# EAGLE design REEF_1V0 (EAGLE 8.3.1)
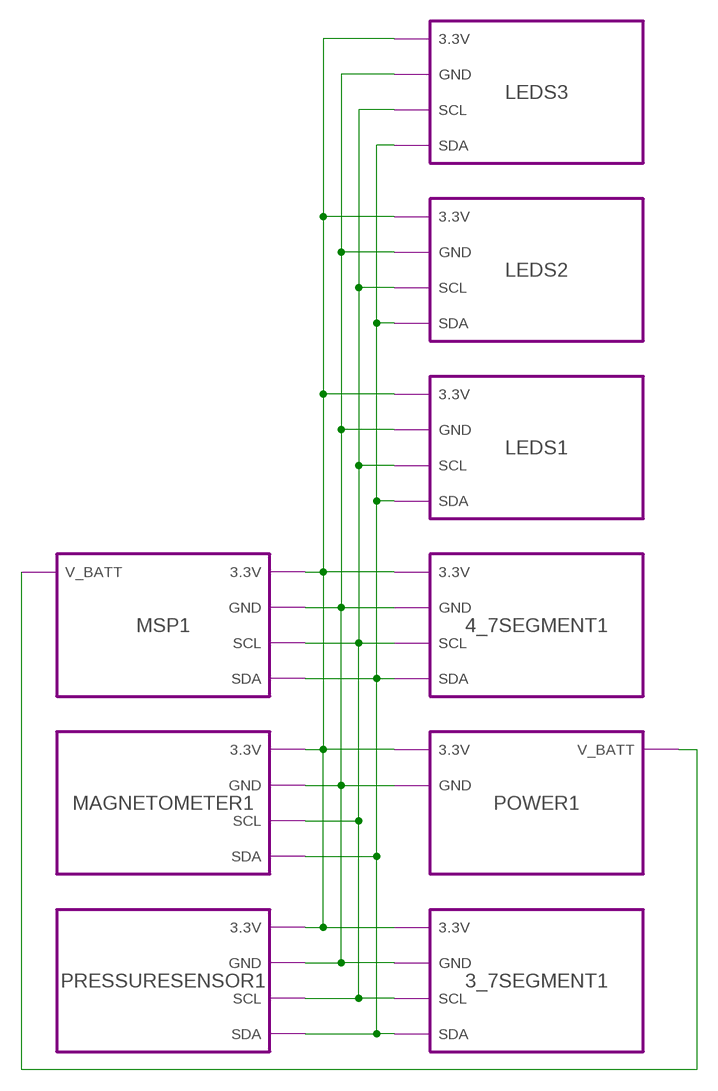
[diagram p0: schematic, sheet 1]

## Module instances
3_7SEGMENT1 = 3_7SEGMENT
4_7SEGMENT1 = 4_7SEGMENT
MAGNETOMETER1 = MAGNETOMETER
POWER1 = POWER
PRESSURESENSOR1 = PRESSURESENSOR
MSP1 = MSP
LEDS1 = LEDS
LEDS2 = LEDS
LEDS3 = LEDS

## Nets
3.3V: port MAGNETOMETER1.3.3V PRESSURESENSOR1.3.3V POWER1.3.3V MSP1.3.3V LEDS3.3.3V 3_7SEGMENT1.3.3V LEDS2.3.3V LEDS1.3.3V 4_7SEGMENT1.3.3V
GND: port MAGNETOMETER1.GND POWER1.GND PRESSURESENSOR1.GND 4_7SEGMENT1.GND 3_7SEGMENT1.GND MSP1.GND LEDS3.GND LEDS2.GND LEDS1.GND
N$1: port POWER1.V_BATT MSP1.V_BATT
SCL: port PRESSURESENSOR1.SCL 4_7SEGMENT1.SCL MAGNETOMETER1.SCL 3_7SEGMENT1.SCL MSP1.SCL LEDS3.SCL LEDS2.SCL LEDS1.SCL
SDA: port PRESSURESENSOR1.SDA 4_7SEGMENT1.SDA MAGNETOMETER1.SDA 3_7SEGMENT1.SDA MSP1.SDA LEDS3.SDA LEDS2.SDA LEDS1.SDA

## Library data of the parts

## Module MAGNETOMETER
Ports: 3.3V(io) GND(io) SCL(io) SDA(io)
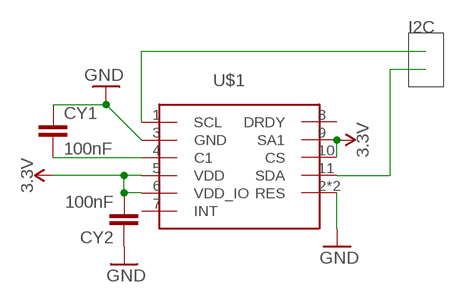
[diagram p1: schematic, module MAGNETOMETER, sheet 1]

### Parts
CY1  100nF  CYYC7B5  [YC7B5]
CY2  100nF  CYYC7B5  [YC7B5]
U$1  LIS3MDLTR  [LGA-12]

### Nets
3.3V: CY2.2 U$1.5(VDD) U$1.6(VDD_IO) U$1.9(SA1) U$1.10(CS)
GND: CY1.1 CY2.1 U$1.2(RES) U$1.3(GND) U$1.12(RES)
N$3: CY1.2 U$1.4(C1)
SCL: U$1.1(SCL)
SDA: U$1.11(SDA)
Unconnected: U$1.7(INT) U$1.8(DRDY)

### Notes on the sheet
- I2C

### Library data of the parts
CY1 CY2 = rcl:CY: Y CAPACITOR for power line
U$1 = LED Driver:LIS3MDLTR

## Module POWER
Ports: GND(io) 3.3V(io) V_BATT(io)
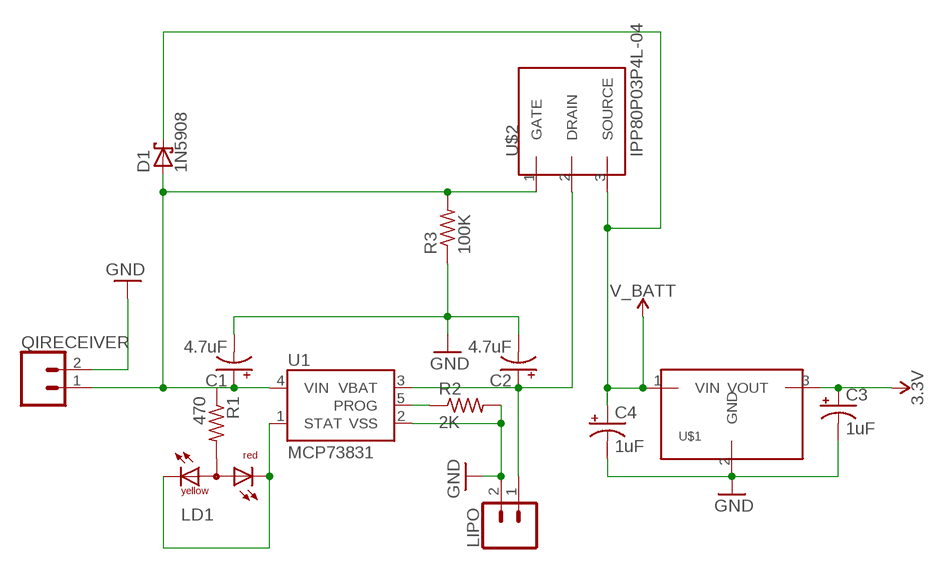
[diagram p2: schematic, module POWER, sheet 1]

### Parts
C1  4.7uF  1000UF-RADIAL-5MM-25V-20%  [CPOL-RADIAL-5MM-10MM]
C2  4.7uF  1000UF-RADIAL-5MM-25V-20%  [CPOL-RADIAL-5MM-10MM]
C3  1uF  1000UF-RADIAL-5MM-25V-20%  [CPOL-RADIAL-5MM-10MM]
C4  1uF  1000UF-RADIAL-5MM-25V-20%  [CPOL-RADIAL-5MM-10MM]
D1  1N5908  [C4111-15]
LD1  DUOLED-RY-A  [DUOLED-A-5MM]
LIPO  CONN_02  [1X02]
QIRECEIVER  CONN_02  [1X02]
R1  470  R-US_VMTA55  [VMTA55]
R2  2K  R-US_VMTA55  [VMTA55]
R3  100K  R-US_VMTA55  [VMTA55]
U1  MCP73831  [SOT23-5]
U$1  MCP1826S  [T03B]
U$2  IPP80P03P4L-04  [T03B]

### Nets
3.3V: C3.+ U$1.3(VOUT)
GND: C1.- C2.- C3.- C4.- LIPO.2 QIRECEIVER.2 R2.2 R3.1 U1.2(VSS) U$1.2(GND)
N$2: C2.+ LIPO.1 U1.3(VBAT) U$2.2(DRAIN)
N$3: LD1.CR LD1.CX(CY) U1.1(STAT)
N$4: C1.+ D1.A QIRECEIVER.1 R1.1 R3.2 U1.4(VIN) U$2.1(GATE)
N$6: R2.1 U1.5(PROG)
N$7: LD1.A R1.2
V_BATT: C4.+ D1.C U$1.1(VIN) U$2.3(SOURCE)

### Library data of the parts
C1-C4 = SparkFun-Capacitors:1000UF: 1,000µF/1mF ceramic capacitors A capacitor is a passive two-terminal electrical component used to store electrical energy temporarily in an electric field. CAP-08070; PROD_ID: CAP-09538; VALUE: 1mF
D1 = diode:1N5908: DIODE schottky
LD1 = led:DUOLED-RY-A: DUO LED 2 colors (red/yellow), 5 mm, round, common Anode www.ligitek.com or other producers.
LIPO QIRECEIVER = SparkFun-Connectors:CONN_02: Multi connection point. Often used as Generic Header-pin footprint for 0.1 inch spaced/style header connections On any of the 0.1 inch spaced packages, you can populate with these: Break Away Headers - Straight <https://www.sparkfun.com/products/116> (PRT-00116) Break Away Male Headers - Right Angle <https://www.sparkfun.com/products/553> (PRT-00553) Female Headers <https://www.sparkfun.com/products/115> (PRT-00115) Break Away Headers - Machine Pin <https://www.sparkfun.com/products/117> (PRT-00117) Break Away Female Headers - Swiss Machine Pin <https://www.sparkfun.com/products/743> (PRT-00743) For SCREWTERMINALS and SPRING TERMINALS visit here: Screw Terimnals on SparkFun.com <https://www.sparkfun.com/search/results?term=Screw+Terminals> (5mm/3.5mm/2.54mm spacing) This device is also useful as a general connection point to wire up your design to another part of your project. Our various solder wires solder well into these plated through hole pads. Hook-Up Wire - Assortment (Stranded, 22 AWG) <https://www.sparkfun.com/products/11375> (PRT-11375) Hook-Up Wire - Assortment (Solid Core, 22 AWG) <https://www.sparkfun.com/products/11367> (PRT-11367) View the entire wire category on our website here <https://www.sparkfun.com/categories/141> Special notes: Molex polarized connector foot print use with: PRT-08233 with associated crimp pins and housings. 2.54_SCREWTERM for use with PRT-10571. 3.5mm Screw Terminal footprints for PRT-08084 5mm Screw Terminal footprints for use with PRT-08432
R1-R3 = rcl:R-US_: RESISTOR, American symbol
U1 = SparkFun-IC-Power:MCP73831: MCP73831T Li-Ion, Li-Pol Controller Miniature single cell, fully integrated Li-Ion, Li-polymer charge management controller Datasheet <http://ww1.microchip.com/downloads/en/DeviceDoc/20001984g.pdf> SparkFun Products: SparkFun ESP32 Thing <https://www.sparkfun.com/products/13907> SparkFun 9DoF Razor IMU M0 <https://www.sparkfun.com/products/14001>; PROD_ID: IC-09995
U$1 = LED Driver:MCP1826S
U$2 = LED Driver:IPP80P03P4L-04

## Module 4_7SEGMENT
Ports: GND(io) SCL(io) SDA(io) 3.3V(io)
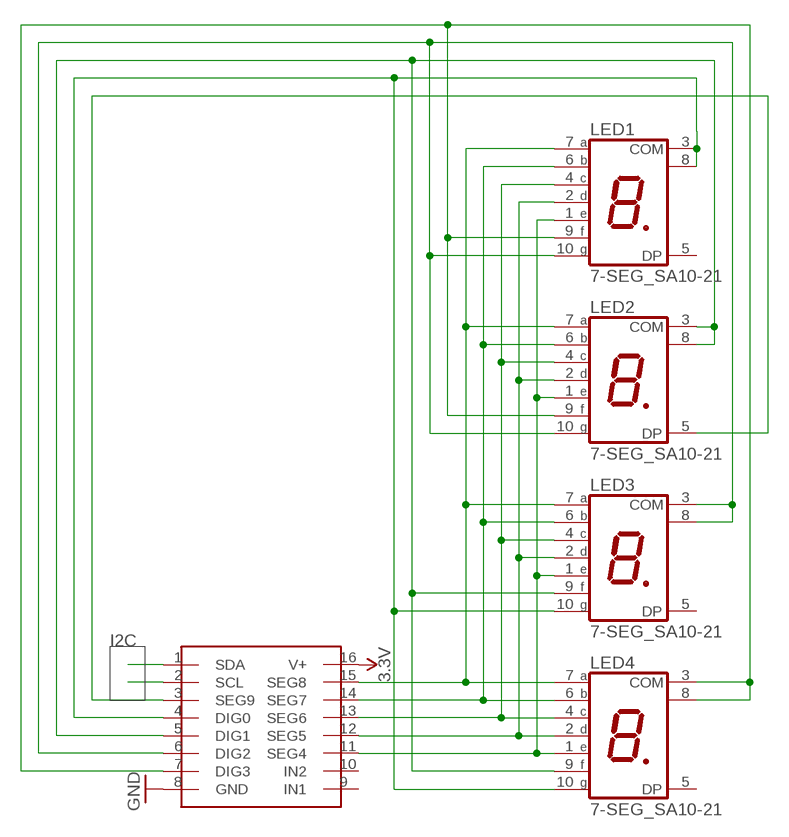
[diagram p3: schematic, module 4_7SEGMENT, sheet 1]

### Parts
LED1  7-SEG_SA10-21  [SA10-21]
LED2  7-SEG_SA10-21  [SA10-21]
LED3  7-SEG_SA10-21  [SA10-21]
LED4  7-SEG_SA10-21  [SA10-21]
U$1  MAX6958BAPE+  [DIP16]

### Nets
3.3V: U$1.16(V+)
GND: U$1.8(GND)
N$1: LED1.7(A) LED2.7(A) LED3.7(A) LED4.7(A) U$1.15(SEG8)
N$2: LED1.6(B) LED2.6(B) LED3.6(B) LED4.6(B) U$1.14(SEG7)
N$3: LED1.4(C) LED2.4(C) LED3.4(C) LED4.4(C) U$1.13(SEG6)
N$4: LED1.2(D) LED2.2(D) LED3.2(D) LED4.2(D) U$1.12(SEG5)
N$5: LED1.1(E) LED2.1(E) LED3.1(E) LED4.1(E) U$1.11(SEG4)
N$6: LED1.3(COM) LED1.8(COM) LED3.10(G) LED4.10(G) U$1.4(DIG0)
N$7: LED2.3(COM) LED2.8(COM) LED3.9(F) LED4.9(F) U$1.5(DIG1)
N$8: LED2.5(DP) U$1.3(SEG9)
N$9: LED1.9(F) LED2.9(F) LED4.3(COM) LED4.8(COM) U$1.7(DIG3)
N$11: LED1.10(G) LED2.10(G) LED3.3(COM) LED3.8(COM) U$1.6(DIG2)
SCL: U$1.2(SCL)
SDA: U$1.1(SDA)
Unconnected: LED1.5(DP) LED3.5(DP) LED4.5(DP) U$1.9(IN1) U$1.10(IN2)

### Notes on the sheet
- I2C

### Library data of the parts
LED1-LED4 = display-kingbright:7-SEG_: Kingbright 14.2mm (0.56 INCH) SINGLE DIGIT NUMERIC DUISPLAY Source: SA56-11EWA(Ver1189471036.pdf; OC_FARNELL: unknown; OC_NEWARK: unknown
U$1 = LED Driver:MAX6958BAPE+

## Module 3_7SEGMENT
Ports: GND(io) SCL(io) SDA(io) 3.3V(io)
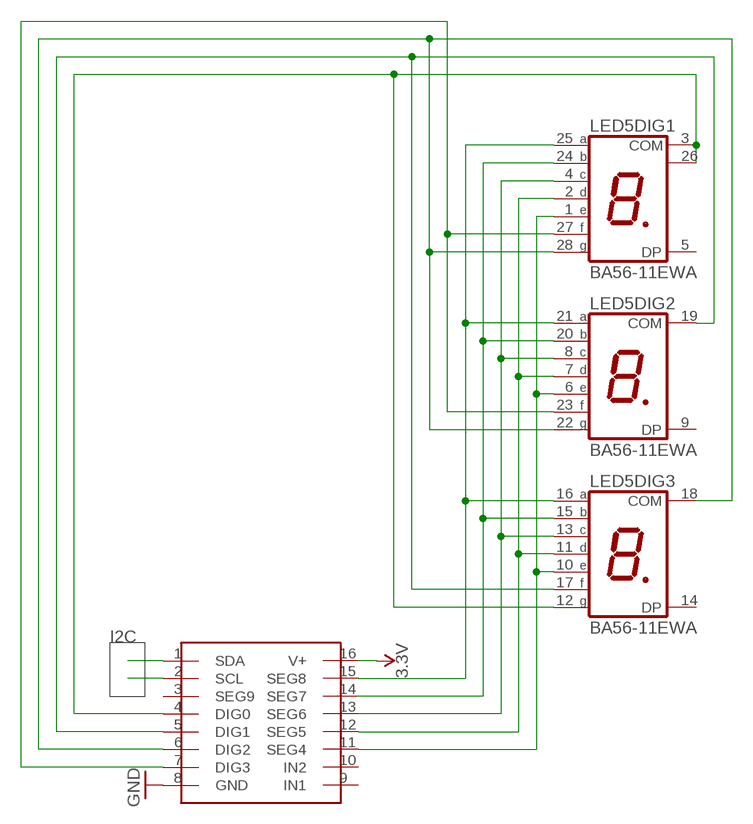
[diagram p4: schematic, module 3_7SEGMENT, sheet 1]

### Parts
LED5  BA56-11EWA  [BA/BC56]
U$1  MAX6958BAPE+  [DIP16]

### Nets
3.3V: U$1.16(V+)
GND: U$1.8(GND)
N$1: LED5.3(DIG1:COM) LED5.12(DIG3:G) LED5.26(DIG1:COM) U$1.4(DIG0)
N$8: LED5.16(DIG3:A) LED5.21(DIG2:A) LED5.25(DIG1:A) U$1.15(SEG8)
N$9: LED5.15(DIG3:B) LED5.20(DIG2:B) LED5.24(DIG1:B) U$1.14(SEG7)
N$10: LED5.4(DIG1:C) LED5.8(DIG2:C) LED5.13(DIG3:C) U$1.13(SEG6)
N$11: LED5.2(DIG1:D) LED5.7(DIG2:D) LED5.11(DIG3:D) U$1.12(SEG5)
N$26: LED5.1(DIG1:E) LED5.6(DIG2:E) LED5.10(DIG3:E) U$1.11(SEG4)
N$28: LED5.17(DIG3:F) LED5.19(DIG2:COM) U$1.5(DIG1)
N$29: LED5.23(DIG2:F) LED5.27(DIG1:F) U$1.7(DIG3)
N$30: LED5.18(DIG3:COM) LED5.22(DIG2:G) LED5.28(DIG1:G) U$1.6(DIG2)
SCL: U$1.2(SCL)
SDA: U$1.1(SDA)
Unconnected: LED5.5(DIG1:DP) LED5.9(DIG2:DP) LED5.14(DIG3:DP) U$1.3(SEG9) U$1.9(IN1) U$1.10(IN2)

### Notes on the sheet
- I2C

### Library data of the parts
LED5 = display-kingbright:B?56-11*WA: 14.22mm (0.56INCH) THREE DIGIT NUMERIC DISPLAY Source: http://www.kingbright.com .. BA56-11EWA(Ver1189474895.pdf; OC_FARNELL: unknown; OC_NEWARK: unknown
U$1 = LED Driver:MAX6958BAPE+

## Module PRESSURESENSOR
Ports: 3.3V(io) GND(io) SCL(io) SDA(io)
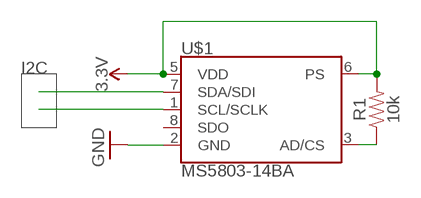
[diagram p5: schematic, module PRESSURESENSOR, sheet 1]

### Parts
R1  10k  10KOHM-HORIZ-1/4W-5%  [AXIAL-0.3]
U$1  MS5803-14BA  [DIL8]

### Nets
3.3V: R1.P$2 U$1.5(VDD) U$1.6(PS)
GND: U$1.2(GND)
N$1: R1.P$1 U$1.3(AD/CS)
SCL: U$1.1(SCL/SCLK)
SDA: U$1.7(SDA/SDI)
Unconnected: U$1.8(SDO)

### Notes on the sheet
- I2C

### Library data of the parts
R1 = SparkFun-Resistors:10KOHM: 10kΩ resistor A resistor is a passive two-terminal electrical component that implements electrical resistance as a circuit element. Resistors act to reduce current flow, and, at the same time, act to lower voltage levels within circuits. - Wikipedia; PROD_ID: RES-09435
U$1 = UnderwaterSensorProject:MS5803-14BA

## Module MSP
Ports: SDA(io) SCL(io) GND(io) 3.3V(io) V_BATT(io)
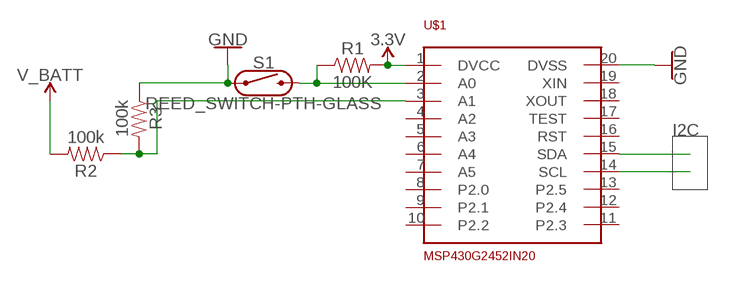
[diagram p6: schematic, module MSP, sheet 1]

### Parts
R1  100K  100OHM-HORIZ-1/4W-1%  [AXIAL-0.3]
R2  100k  100KOHM-HORIZ-1/4W-1%  [AXIAL-0.3]
R3  100k  100KOHM-HORIZ-1/4W-1%  [AXIAL-0.3]
S1  REED_SWITCH-PTH-GLASS  [REED_SWITCH_GLASS]
U$1  MSP430G2452IN20  [DIL20]

### Nets
3.3V: R1.P$2 U$1.1(DVCC)
GND: R3.P$1 S1.P$1 U$1.20(DVSS)
N$1: R1.P$1 S1.P$2 U$1.2(A0)
N$2: R2.P$1 R3.P$2 U$1.3(A1)
SCL: U$1.14(SCL)
SDA: U$1.15(SDA)
V_BATT: R2.P$2
Unconnected: U$1.4(A2) U$1.5(A3) U$1.6(A4) U$1.7(A5) U$1.8(P2.0) U$1.9(P2.1) U$1.10(P2.2) U$1.11(P2.3) U$1.12(P2.4) U$1.13(P2.5) U$1.16(RST) U$1.17(TEST) U$1.18(XOUT) U$1.19(XIN)

### Notes on the sheet
- I2C

### Library data of the parts
R1 = SparkFun-Resistors:100OHM: 100Ω resistor A resistor is a passive two-terminal electrical component that implements electrical resistance as a circuit element. Resistors act to reduce current flow, and, at the same time, act to lower voltage levels within circuits. - Wikipedia; PROD_ID: RES-12181; VALUE: 100
R2 R3 = SparkFun-Resistors:100KOHM: 100kΩ resistor A resistor is a passive two-terminal electrical component that implements electrical resistance as a circuit element. Resistors act to reduce current flow, and, at the same time, act to lower voltage levels within circuits. - Wikipedia; PROD_ID: RES-12184
S1 = SparkFun-Switches:REED_SWITCH: Reed Switch A reed switch is a magnetically-actuated switch. When the device is exposed to a magnetic field, the two ferrous materials inside the switch pull together and the switch closes. Variant Overview PTH-GLASS Reed Switch <https://www.sparkfun.com/products/8642> (COM-08642) - PTH reed switch w/ glass body (6.0 x 0.9 mm) PTH-INSULATED Reed Switch - Insulated <https://www.sparkfun.com/products/10601> (COM-10601) - PTH reed switch w/ insulated body (15.1 x 4.2 mm); PROD_ID: SWCH-09282; SF_SKU: COM-08642
U$1 = UnderwaterSensorProject:MSP430G2452IN20

## Module LEDS
Ports: SDA(io) SCL(io) GND(io) 3.3V(io)
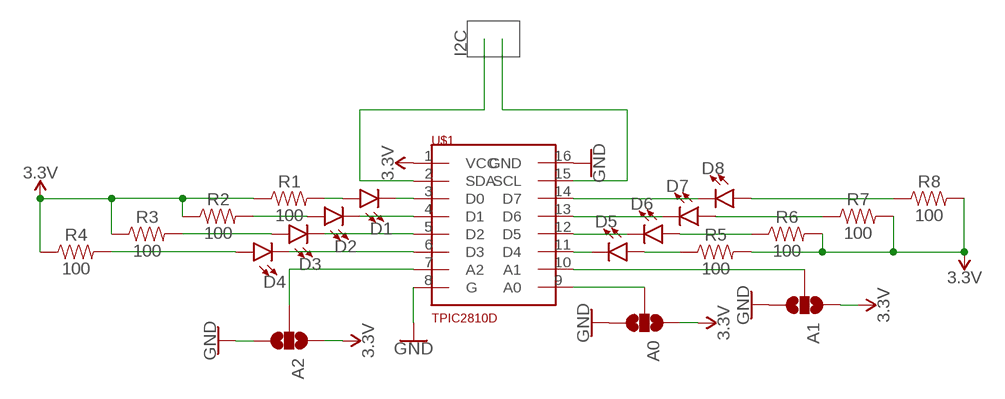
[diagram p7: schematic, module LEDS, sheet 1]

### Parts
A0  JUMPER-SMT_3_NO_SILK  [SMT-JUMPER_3_NO_SILK]
A1  JUMPER-SMT_3_NO_SILK  [SMT-JUMPER_3_NO_SILK]
A2  JUMPER-SMT_3_NO_SILK  [SMT-JUMPER_3_NO_SILK]
D1  LED5MM  [LED_5MM]
D2  LED5MM  [LED_5MM]
D3  LED5MM  [LED_5MM]
D4  LED5MM  [LED_5MM]
D5  LED5MM  [LED_5MM]
D6  LED5MM  [LED_5MM]
D7  LED5MM  [LED_5MM]
D8  LED5MM  [LED_5MM]
R1  100  100OHM-HORIZ-1/4W-1%  [AXIAL-0.3]
R2  100  100OHM-HORIZ-1/4W-1%  [AXIAL-0.3]
R3  100  100OHM-HORIZ-1/4W-1%  [AXIAL-0.3]
R4  100  100OHM-HORIZ-1/4W-1%  [AXIAL-0.3]
R5  100  100OHM-HORIZ-1/4W-1%  [AXIAL-0.3]
R6  100  100OHM-HORIZ-1/4W-1%  [AXIAL-0.3]
R7  100  100OHM-HORIZ-1/4W-1%  [AXIAL-0.3]
R8  100  100OHM-HORIZ-1/4W-1%  [AXIAL-0.3]
U$1  TPIC2810D  [SO16]

### Nets
3.3V: A0.1 A1.1 A2.1 R1.P$1 R2.P$1 R3.P$1 R4.P$1 R5.P$2 R6.P$2 R7.P$2 R8.P$2 U$1.1(VCC)
GND: A0.3 A1.3 A2.3 U$1.8(G) U$1.16(GND)
N$1: D1.K(C) U$1.3(D0)
N$2: D2.K(C) U$1.4(D1)
N$3: D3.K(C) U$1.5(D2)
N$4: D4.K(C) U$1.6(D3)
N$5: D5.K(C) U$1.11(D4)
N$6: D6.K(C) U$1.12(D5)
N$7: D7.K(C) U$1.13(D6)
N$8: D8.K(C) U$1.14(D7)
N$9: A2.2 U$1.7(A2)
N$10: A1.2 U$1.10(A1)
N$11: A0.2 U$1.9(A0)
N$12: D5.A R5.P$1
N$13: D6.A R6.P$1
N$14: D7.A R7.P$1
N$15: D8.A R8.P$1
N$16: D1.A R1.P$2
N$18: D2.A R2.P$2
N$19: D3.A R3.P$2
N$20: D4.A R4.P$2
SCL: U$1.15(SCL)
SDA: U$1.2(SDA)

### Notes on the sheet
- I2C

### Library data of the parts
A0 A1 A2 = SparkFun-Jumpers:JUMPER-SMT_3_NO: Normally open jumper This jumper has three pads in close proximity to each other. Apply solder to close the connection(s).
D1-D8 = SparkFun-LED:LED: LED (Generic) Standard schematic elements and footprints for 5mm, 3mm, 1206, and 0603 sized LEDs. Generic LEDs with no color specified.
R1-R8 = SparkFun-Resistors:100OHM: 100Ω resistor A resistor is a passive two-terminal electrical component that implements electrical resistance as a circuit element. Resistors act to reduce current flow, and, at the same time, act to lower voltage levels within circuits. - Wikipedia; PROD_ID: RES-12181
U$1 = UnderwaterSensorProject:TPIC2810D

## Board
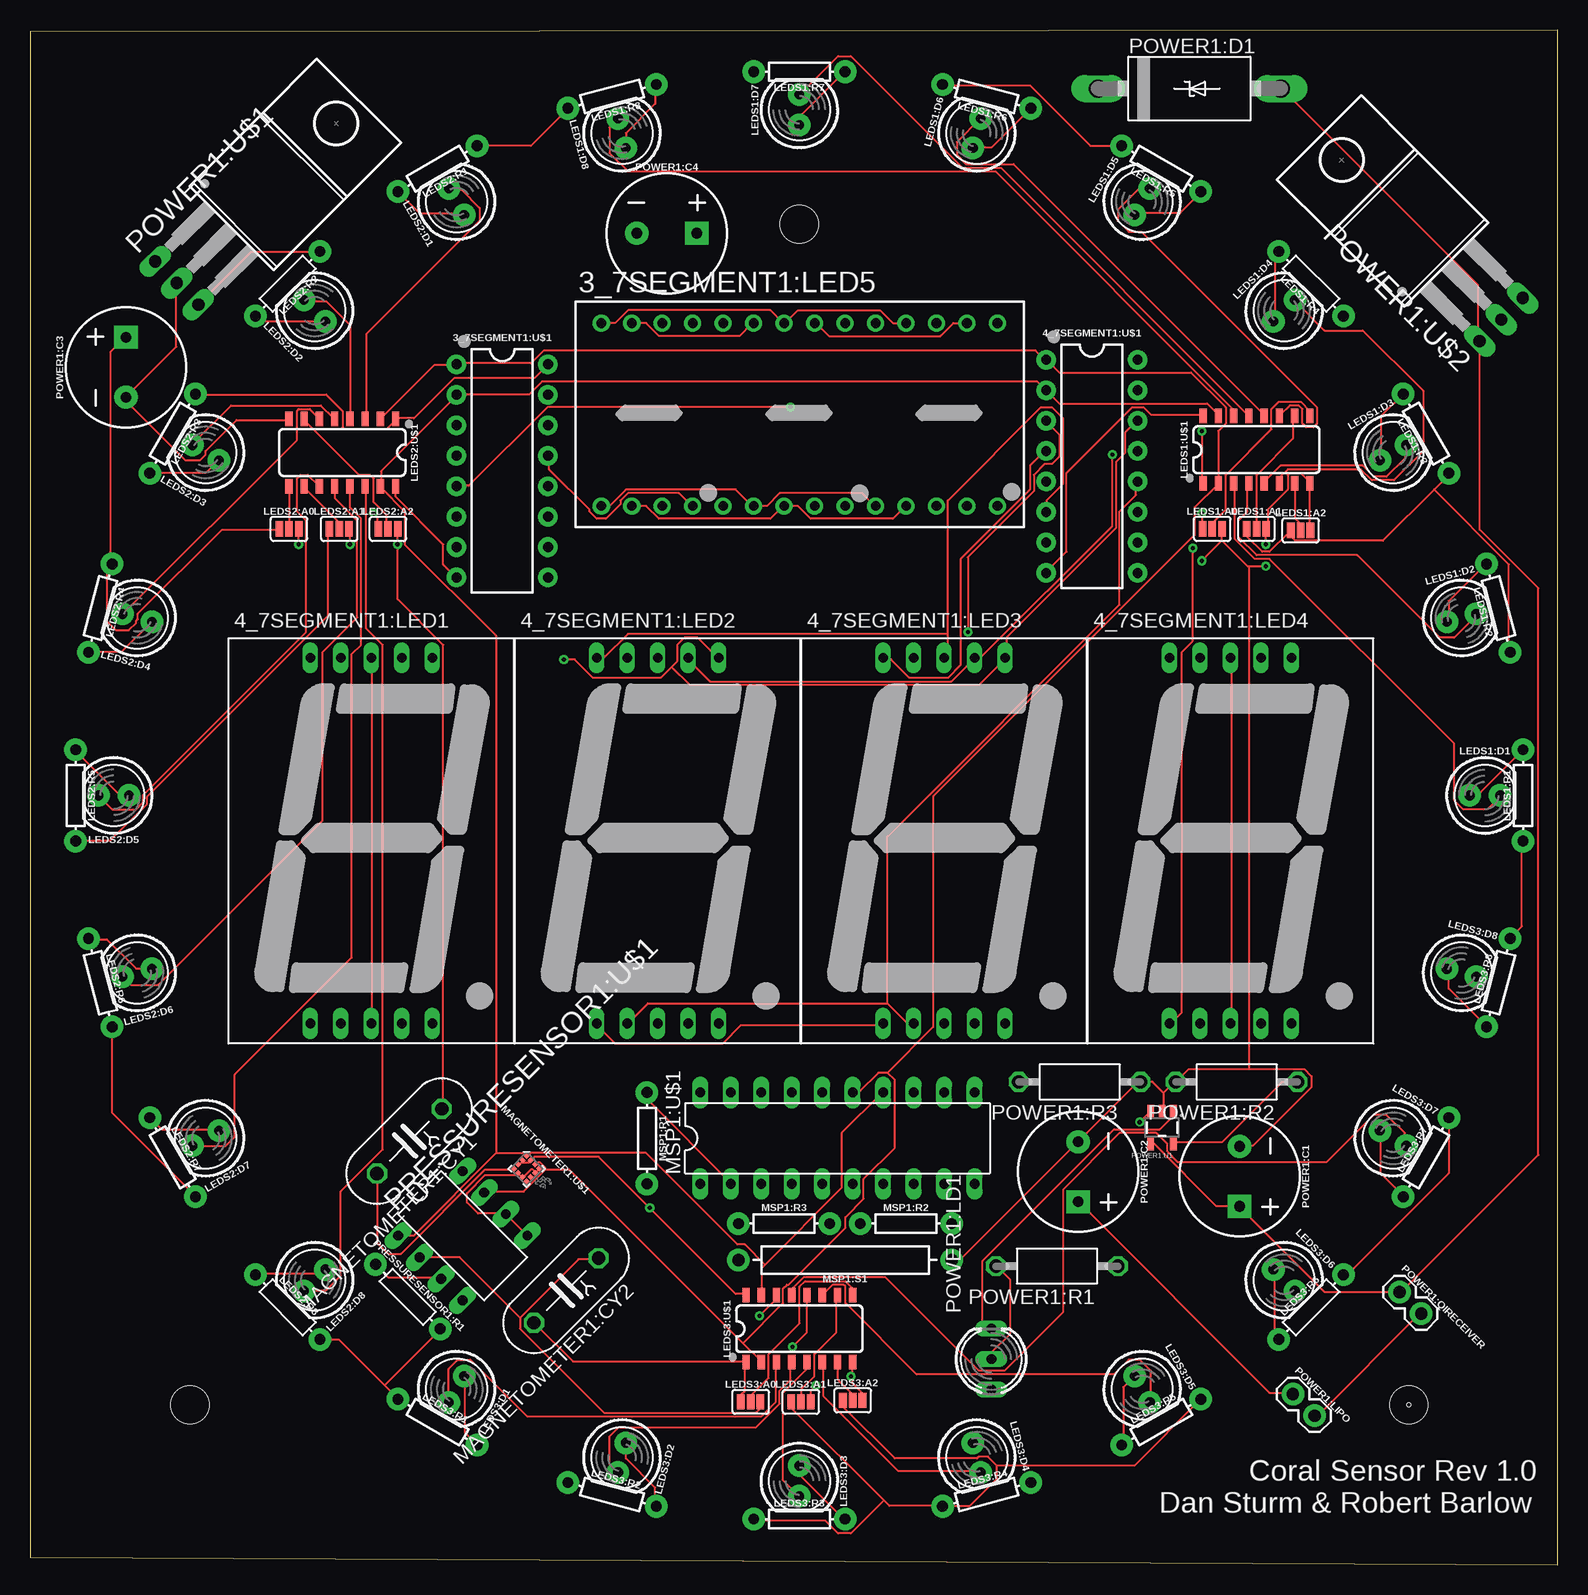
[diagram p8: board, top side]
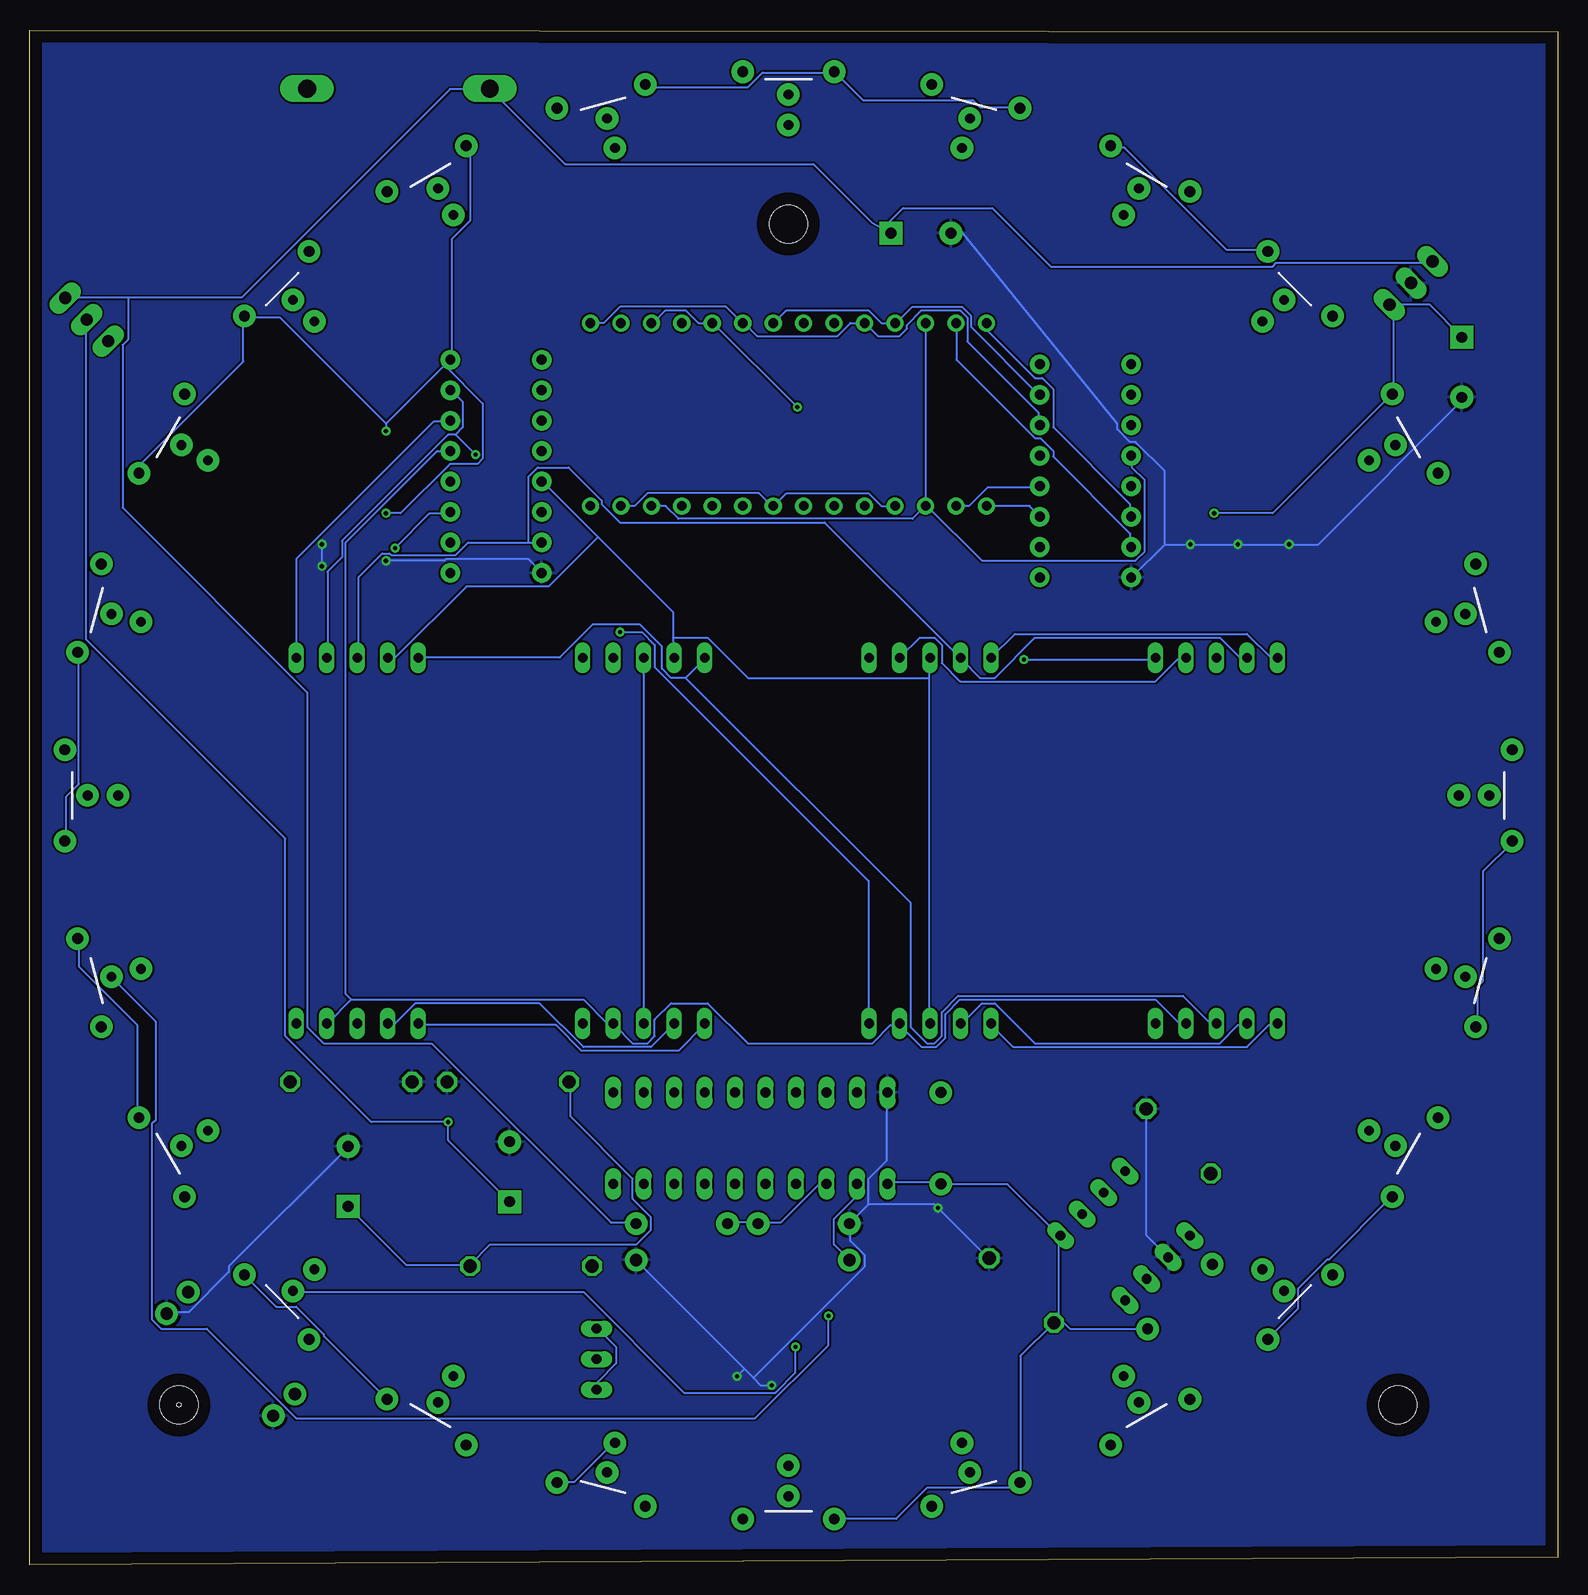
[diagram p9: board, bottom side, seen from below]

Size 127.36 x 127.94 mm. Coordinates in mm from the lower left corner, seen from the top.
Outline: 0,0.64 127.36,0 127.36,127.94 0,127.81 0,0.64
Copper layers (1*16): Top 0.035mm / dielectric 1.5mm / Bottom 0.035mm
Design rules "default *": minimum track width 6mil, minimum drill 0.35mm, track to track 6mil, track to pad 6mil, pad to pad 5mil, via to via 6mil, smd to smd 6mil, copper to edge 40mil, drill to drill 6mil, minimum pad ring 10mil, minimum via ring 8mil, stop-mask expansion 4mil, vias tented up to drill 0mil, thermal gap 10mil
Holes 3.17 mm at 64.14,111.76 13.34,13.33 114.94,13.33
Holes 0.35 mm at 114.94,13.33

### Footprints (pad centres in the part's own frame; a part is rotated, then mirrored left to right if it is on the bottom)
BA/BC56 = drill 0.8 pad 1.422: 1 -16.51,-7.62; 2 -13.97,-7.62; 3 -11.43,-7.62; 4 -8.89,-7.62; 5 -6.35,-7.62; 6 -3.81,-7.62; 7 -1.27,-7.62; 8 1.27,-7.62; 9 3.81,-7.62; 10 6.35,-7.62; 11 8.89,-7.62; 12 11.43,-7.62; 13 13.97,-7.62; 14 16.51,-7.62; 15 16.51,7.62; 16 13.97,7.62; 17 11.43,7.62; 18 8.89,7.62; 19 6.35,7.62; 20 3.81,7.62; 21 1.27,7.62; 22 -1.27,7.62; 23 -3.81,7.62; 24 -6.35,7.62; 25 -8.89,7.62; 26 -11.43,7.62; 27 -13.97,7.62; 28 -16.51,7.62
DIP16 = drill 0.813 pad 1.626: 1 -8.89,-3.81; 2 -6.35,-3.81; 3 -3.81,-3.81; 4 -1.27,-3.81; 5 1.27,-3.81; 6 3.81,-3.81; 7 6.35,-3.81; 8 8.89,-3.81; 9 8.89,3.81; 10 6.35,3.81; 11 3.81,3.81; 12 1.27,3.81; 13 -1.27,3.81; 14 -3.81,3.81; 15 -6.35,3.81; 16 -8.89,3.81
SA10-21 = drill 0.8 long: 1 -5.08,-15.2; 2 -2.54,-15.2; 3 0,-15.2; 4 2.54,-15.2; 5 5.08,-15.2; 6 5.08,15.28; 7 2.54,15.28; 8 0,15.28; 9 -2.54,15.28; 10 -5.08,15.28
SMT-JUMPER_3_NO_SILK = smd 0.635 x 1.27: 1 -0.813,0; 2 0,0; 3 0.813,0
LED_5MM = drill 0.813 pad 1.88: A -1.27,0; K 1.27,0
AXIAL-0.3 = drill 0.9 pad 1.88: P$1 -3.81,0; P$2 3.81,0
SO16 = smd 0.6 x 1.2: 1 -4.445,-2.8; 2 -3.175,-2.8; 3 -1.905,-2.8; 4 -0.635,-2.8; 5 0.635,-2.8; 6 1.905,-2.8; 7 3.175,-2.8; 8 4.445,-2.8; 9 4.445,2.8; 10 3.175,2.8; 11 1.905,2.8; 12 0.635,2.8; 13 -0.635,2.8; 14 -1.905,2.8; 15 -3.175,2.8; 16 -4.445,2.8
YC7B5 = drill 1.118 octagon: 1 -3.81,0; 2 3.81,0
LGA-12 = smd 0.375 x 0.35: 1 -0.75,0.75; 2 -0.75,0.25; 3 -0.75,-0.25; 4 -0.75,-0.75; 7 0.75,-0.75; 8 0.75,-0.25; 9 0.75,0.25; 10 0.75,0.75 | smd 0.35 x 0.375: 5 -0.25,-0.75; 6 0.25,-0.75; 11 0.25,0.75; 12 -0.25,0.75
REED_SWITCH_GLASS = drill 1.016 pad 1.88: P$1 -8.89,0; P$2 8.89,0
DIL20 = drill 0.813 long: 1 -11.43,-3.81; 2 -8.89,-3.81; 3 -6.35,-3.81; 4 -3.81,-3.81; 5 -1.27,-3.81; 6 1.27,-3.81; 7 3.81,-3.81; 8 6.35,-3.81; 9 8.89,-3.81; 10 11.43,-3.81; 11 11.43,3.81; 12 8.89,3.81; 13 6.35,3.81; 14 3.81,3.81; 15 1.27,3.81; 16 -1.27,3.81; 17 -3.81,3.81; 18 -6.35,3.81; 19 -8.89,3.81; 20 -11.43,3.81
CPOL-RADIAL-5MM-10MM = drill 0.9 pad 1.93 square: + 2.5,0 | drill 0.9 pad 1.93: - -2.5,0
C4111-15 = drill 1.499 long: A 7.62,0; C -7.62,0
DUOLED-A-5MM = drill 0.813 long: A 0,0; CR 2.54,0; CX -2.54,0
1X02 = drill 1.016 pad 1.88: 1 0,0; 2 2.54,0
VMTA55 = drill 1.1 octagon: 1 -5.08,0; 2 5.08,0
SOT23-5 = smd 0.55 x 1.2: 1 -0.95,-1.3; 2 0,-1.3; 3 0.95,-1.3; 4 0.95,1.3; 5 -0.95,1.3
T03B = drill 1.016 long: 1 -2.54,-11.43; 2 0,-11.43; 3 2.54,-11.43
DIL8 = drill 0.813 long: 1 -3.81,-3.81; 2 -1.27,-3.81; 3 1.27,-3.81; 4 3.81,-3.81; 5 3.81,3.81; 6 1.27,3.81; 7 -1.27,3.81; 8 -3.81,3.81

### Placement (x,y rotation side)
3_7SEGMENT1:LED5  BA56-11EWA  [BA/BC56]  64.14,95.89 0 top
3_7SEGMENT1:U$1  MAX6958BAPE+  [DIP16]  39.37,91.19 270 top
4_7SEGMENT1:LED1  7-SEG_SA10-21  [SA10-21]  28.45,60.32 0 top
4_7SEGMENT1:LED2  7-SEG_SA10-21  [SA10-21]  52.32,60.32 0 top
4_7SEGMENT1:LED3  7-SEG_SA10-21  [SA10-21]  76.2,60.32 0 top
4_7SEGMENT1:LED4  7-SEG_SA10-21  [SA10-21]  100.08,60.32 0 top
4_7SEGMENT1:U$1  MAX6958BAPE+  [DIP16]  88.52,91.57 270 top
LEDS1:A0  [SMT-JUMPER_3_NO_SILK]  98.55,86.36 0 top
LEDS1:A1  [SMT-JUMPER_3_NO_SILK]  102.23,86.36 0 top
LEDS1:A2  [SMT-JUMPER_3_NO_SILK]  105.92,86.23 0 top
LEDS1:D1  [LED_5MM]  121.28,64.14 0 top
LEDS1:D2  [LED_5MM]  119.34,78.93 15 top
LEDS1:D3  [LED_5MM]  113.63,92.71 30 top
LEDS1:D4  [LED_5MM]  104.55,104.55 45 top
LEDS1:D5  [LED_5MM]  92.71,113.63 60 top
LEDS1:D6  [LED_5MM]  78.93,119.34 75 top
LEDS1:D7  [LED_5MM]  64.14,121.29 90 top
LEDS1:D8  [LED_5MM]  49.34,119.34 105 top
LEDS1:R1  100  [AXIAL-0.3]  124.46,64.14 90 top
LEDS1:R2  100  [AXIAL-0.3]  122.4,79.75 105 top
LEDS1:R3  100  [AXIAL-0.3]  116.38,94.3 120 top
LEDS1:R4  100  [AXIAL-0.3]  106.79,106.79 135 top
LEDS1:R5  100  [AXIAL-0.3]  94.3,116.38 150 top
LEDS1:R6  100  [AXIAL-0.3]  79.75,122.4 165 top
LEDS1:R7  100  [AXIAL-0.3]  64.14,124.46 180 top
LEDS1:R8  100  [AXIAL-0.3]  48.52,122.4 195 top
LEDS1:U$1  TPIC2810D  [SO16]  102.23,92.96 0 top
LEDS2:A0  [SMT-JUMPER_3_NO_SILK]  21.59,86.36 0 top
LEDS2:A1  [SMT-JUMPER_3_NO_SILK]  25.78,86.36 0 top
LEDS2:A2  [SMT-JUMPER_3_NO_SILK]  29.84,86.36 0 top
LEDS2:D1  [LED_5MM]  35.56,113.63 120 top
LEDS2:D2  [LED_5MM]  23.72,104.55 135 top
LEDS2:D3  [LED_5MM]  14.64,92.71 150 top
LEDS2:D4  [LED_5MM]  8.93,78.93 165 top
LEDS2:D5  [LED_5MM]  6.99,64.14 180 top
LEDS2:D6  [LED_5MM]  8.93,49.34 195 top
LEDS2:D7  [LED_5MM]  14.64,35.56 210 top
LEDS2:D8  [LED_5MM]  23.72,23.72 225 top
LEDS2:R1  100  [AXIAL-0.3]  33.97,116.38 210 top
LEDS2:R2  100  [AXIAL-0.3]  21.48,106.79 225 top
LEDS2:R3  100  [AXIAL-0.3]  11.89,94.3 240 top
LEDS2:R4  100  [AXIAL-0.3]  5.87,79.75 255 top
LEDS2:R5  100  [AXIAL-0.3]  3.81,64.14 270 top
LEDS2:R6  100  [AXIAL-0.3]  5.87,48.52 285 top
LEDS2:R7  100  [AXIAL-0.3]  11.89,33.97 300 top
LEDS2:R8  100  [AXIAL-0.3]  21.48,21.48 315 top
LEDS2:U$1  TPIC2810D  [SO16]  26.04,92.71 180 top
LEDS3:A0  [SMT-JUMPER_3_NO_SILK]  60.07,13.59 0 top
LEDS3:A1  [SMT-JUMPER_3_NO_SILK]  64.26,13.59 0 top
LEDS3:A2  [SMT-JUMPER_3_NO_SILK]  68.58,13.72 0 top
LEDS3:D1  [LED_5MM]  35.56,14.64 240 top
LEDS3:D2  [LED_5MM]  49.34,8.93 255 top
LEDS3:D3  [LED_5MM]  64.14,6.98 270 top
LEDS3:D4  [LED_5MM]  78.93,8.93 285 top
LEDS3:D5  [LED_5MM]  92.71,14.64 300 top
LEDS3:D6  [LED_5MM]  104.55,23.72 315 top
LEDS3:D7  [LED_5MM]  113.63,35.56 330 top
LEDS3:D8  [LED_5MM]  119.34,49.34 345 top
LEDS3:R1  100  [AXIAL-0.3]  33.97,11.89 330 top
LEDS3:R2  100  [AXIAL-0.3]  48.52,5.87 345 top
LEDS3:R3  100  [AXIAL-0.3]  64.14,3.81 0 top
LEDS3:R4  100  [AXIAL-0.3]  79.75,5.87 15 top
LEDS3:R5  100  [AXIAL-0.3]  94.3,11.89 30 top
LEDS3:R6  100  [AXIAL-0.3]  106.79,21.48 45 top
LEDS3:R7  100  [AXIAL-0.3]  116.38,33.97 60 top
LEDS3:R8  100  [AXIAL-0.3]  122.4,48.52 75 top
LEDS3:U$1  TPIC2810D  [SO16]  64.14,19.69 0 top
MAGNETOMETER1:CY1  100nF  [YC7B5]  31.62,35.31 225 top
MAGNETOMETER1:CY2  100nF  [YC7B5]  44.7,22.86 225 top
MAGNETOMETER1:U$1  [LGA-12]  41.4,33.02 315 top
MSP1:R1  100K  [AXIAL-0.3]  51.44,35.56 270 top
MSP1:R2  100k  [AXIAL-0.3]  73.03,28.45 0 top
MSP1:R3  100k  [AXIAL-0.3]  62.87,28.45 0 top
MSP1:S1  REED_SWITCH-PTH-GLASS  [REED_SWITCH_GLASS]  67.94,25.4 180 top
MSP1:U$1  MSP430G2452IN20  [DIL20]  67.31,35.56 0 top
POWER1:C1  4.7uF  [CPOL-RADIAL-5MM-10MM]  100.84,32.38 270 top
POWER1:C2  4.7uF  [CPOL-RADIAL-5MM-10MM]  87.38,32.77 270 top
POWER1:C3  1uF  [CPOL-RADIAL-5MM-10MM]  8,99.82 90 top
POWER1:C4  1uF  [CPOL-RADIAL-5MM-10MM]  53.09,111 0 top
POWER1:D1  1N5908  [C4111-15]  96.65,123.06 0 top
POWER1:LD1  [DUOLED-A-5MM]  80.14,17.15 90 top
POWER1:LIPO  [1X02]  105.28,14.22 315 top
POWER1:QIRECEIVER  [1X02]  114.17,22.73 315 top
POWER1:R1  470  [VMTA55]  85.6,24.89 180 top
POWER1:R2  2K  [VMTA55]  100.58,40.26 180 top
POWER1:R3  100K  [VMTA55]  87.5,40.26 180 top
POWER1:U1  MCP73831  [SOT23-5]  94.36,36.45 180 top
POWER1:U$1  MCP1826S  [T03B]  20.32,114.94 315 top
POWER1:U$2  IPP80P03P4L-04  [T03B]  114.55,111.89 45 top
PRESSURESENSOR1:R1  10k  [AXIAL-0.3]  31.5,22.35 315 top
PRESSURESENSOR1:U$1  MS5803-14BA  [DIL8]  36.07,27.43 315 top

### Tracks (layer width: path | path; a pad name or v marks a point on that pad's centre or on a via)
3.3V  (via drill 0.35)
  Top 0.152: LEDS2:A1.1 24.84,86.28 24.84,79.12 9.75,64.03 9.75,63.42 6.71,60.38 3.81,60.38 LEDS2:R5.P$2 | 29.57,14.96 30.63,13.89 LEDS3:R1.P$1 | 29.57,14.96 25.76,18.77 24.23,18.77 LEDS2:R8.P$2 | 29.57,14.96 34.14,19.53 PRESSURESENSOR1:R1.P$2 | 71.17,5.36 71.63,4.9 76.05,4.9 LEDS3:R4.P$1 76.2,4.9 78.33,4.9 80.62,7.19 80.62,8.26 | 71.17,5.36 63.55,12.98 63.55,13.59 LEDS3:A1.1 | 80.62,8.26 79.86,9.02 79.1,9.02 78.94,8.87 72.08,8.87 67.82,13.13 67.82,13.59 LEDS3:A2.1 | 71.17,5.36 68.43,2.62 67.36,2.62 66.29,3.68 60.35,3.68 LEDS3:R3.P$1 | 40.69,32.64 41,32.33 MAGNETOMETER1:U$1.6 41.15,32.33 41.76,32.94 41.91,32.94 42.06,32.79 MAGNETOMETER1:U$1.9 42.22,32.79 42.37,32.94 MAGNETOMETER1:U$1.10 | 40.69,32.64 40.54,32.49 37.95,32.49 36.42,30.96 36.42,30.2 37.34,29.29 39.62,29.29 PRESSURESENSOR1:U$1.6 39.78,29.13 41.45,27.46 PRESSURESENSOR1:U$1.5 | 40.69,32.64 MAGNETOMETER1:U$1.5 | LEDS3:A0.1 59.28,13.59 59.28,14.2 59.59,14.5 59.59,16.79 LEDS3:U$1.1 59.59,16.94 45.26,16.94 42.06,20.14 MAGNETOMETER1:CY2.2 | LEDS2:R6.P$2 6.86,44.83 6.86,37.67 13.72,30.81 LEDS2:R7.P$2 | v97.69,94.51 97.69,90.25 LEDS1:U$1.1 | v97.69,87.66 97.69,86.44 LEDS1:A0.1 | 104.85,85.98 LEDS1:A2.1 105,86.13 | 104.85,85.98 103.33,84.45 102.72,84.45 101.5,85.67 101.5,86.28 LEDS1:A1.1 | 104.85,85.98 105.46,85.37 112.78,85.37 117.04,89.64 | 117.04,89.64 118.26,90.86 LEDS1:R3.P$1 | LEDS1:R1.P$1 124.36,60.22 124.36,53.21 123.44,52.3 LEDS3:R8.P$2 | 117.04,89.64 123.29,83.39 123.29,76.07 LEDS1:R2.P$1 | LEDS3:R6.P$2 109.58,24.26 109.88,24.26 118.26,32.64 118.26,37.21 LEDS3:R7.P$2 | LEDS2:R1.P$1 37.34,118.29 41.76,118.29 44.81,121.34 LEDS1:R8.P$2
  Top 0.152: LEDS1:R5.P$2 90.98,118.29 88.39,118.29 83.36,123.32 76.2,123.32 LEDS1:R6.P$2 | 3_7SEGMENT1:U$1.16 43.13,100 42.06,98.93 35.36,98.93 32,95.58 30.48,95.58 LEDS2:U$1.1 30.48,95.43 29.72,94.67 26.21,94.67 26.06,94.82 26.06,96.19 24.69,97.56 13.87,97.56 LEDS2:R3.P$1 | v28.65,87.66 28.96,87.35 28.96,86.44 LEDS2:A2.1 | LEDS2:A0.1 20.73,86.28 16,86.28 8.99,79.27 8.99,78.82 8.84,78.66 8.84,78.51 8.23,77.9 7.16,77.9 6.4,78.66 6.4,83.08 6.71,83.39 LEDS2:R4.P$1 6.71,83.54 6.71,101.07 7.92,102.29 POWER1:C3.+ | LEDS2:R2.P$1 24.08,109.45 18.44,109.45 14.17,105.18 POWER1:U$1.3 | 80.62,8.26 92.05,8.26 97.54,13.74 LEDS3:R5.P$2
  Bottom 0.152: LEDS2:R6.P$2 6.71,44.98 6.71,48.18 6.25,48.64 6.25,57.78 3.81,60.22 LEDS2:R5.P$2 | LEDS2:R7.P$2 13.87,30.66 19.05,25.48 19.2,25.48 21.64,23.04 21.64,21.36 24.08,18.92 LEDS2:R8.P$2 | MSP1:U$1.1 55.78,31.88 51.51,31.88 MSP1:R1.P$2 51.36,31.73 45.87,31.73 41.6,27.46 PRESSURESENSOR1:U$1.5 41.6,27.31 41.6,20.6 | MAGNETOMETER1:CY2.2 42.06,20.14 44.81,17.4 44.81,6.88 LEDS3:R2.P$1 44.96,6.73 45.26,6.43 52.58,6.43 55.17,3.83 60.2,3.83 LEDS3:R3.P$1 | 41.6,20.6 41.91,20.3 MAGNETOMETER1:CY2.2 | 41.6,20.6 40.69,19.69 34.29,19.69 PRESSURESENSOR1:R1.P$2 | 41.6,20.6 MAGNETOMETER1:CY2.2 | 97.69,95.12 v97.69,94.51 | 92.81,100 92.35,100.46 4_7SEGMENT1:U$1.16 | 92.81,100 97.69,95.12 | v97.69,87.66 96.47,87.66 92.35,91.77 90.07,91.77 89.61,92.23 89.61,96.8 92.81,100 | 92.81,100 4_7SEGMENT1:U$1.16 | 97.69,95.12 106.53,103.96 109.42,103.96 LEDS1:R4.P$1 109.58,103.96 109.58,100.31 118.26,91.62 118.26,91.01 LEDS1:R3.P$1 | LEDS3:R5.P$2 97.69,13.89 102.87,19.08 102.87,19.23 105.16,21.51 106.83,21.51 109.42,24.11 LEDS3:R6.P$2 | LEDS3:R7.P$2 118.42,37.36 118.42,44.98 123.29,49.86 123.29,52.15 LEDS3:R8.P$2 | LEDS1:R2.P$1 123.29,75.92 123.29,65.1 124.36,64.03 124.36,60.38 LEDS1:R1.P$1 | LEDS1:R6.P$2 76.05,123.32 75.89,123.17 67.51,123.17 66.29,124.38 60.35,124.38 LEDS1:R7.P$2 60.2,124.38 57.91,122.1 48.77,122.1 48.16,121.49 44.96,121.49 LEDS1:R8.P$2 | v28.65,87.66 23.77,87.66 13.87,97.56 LEDS2:R3.P$1 13.72,97.71 13.72,105.03 | 13.72,105.03 10.67,105.03 8.08,102.44 POWER1:C3.+ | 13.72,105.03 14.02,105.03 POWER1:U$1.3 13.72,105.03 | LEDS2:R1.P$1 37.19,118.14 36.12,118.14 27.58,109.6 24.23,109.6 LEDS2:R2.P$1
  Bottom 0.152: 4_7SEGMENT1:U$1.16 92.2,100.46 92.2,110.52 90.68,112.04 90.68,117.83 90.98,118.14 LEDS1:R5.P$2
3_7SEGMENT1:N$1
  Bottom 0.152: 52.73,88.27 52.73,103.51 3_7SEGMENT1:LED5.26 | 3_7SEGMENT1:LED5.12 74.37,88.27 73.3,87.2 53.8,87.2 52.73,88.27 | 52.73,88.27 3_7SEGMENT1:LED5.3 52.58,88.27 48.01,83.69 35.2,83.69 34.44,84.45 34.44,90.4 35.51,91.47 35.51,92.38 3_7SEGMENT1:U$1.4
3_7SEGMENT1:N$8
  Top 0.152: 3_7SEGMENT1:LED5.16 76.96,103.51 75.89,102.44 66.6,102.44 65.53,103.51 3_7SEGMENT1:LED5.21
  Bottom 0.152: 3_7SEGMENT1:LED5.21 65.38,103.51 64.31,104.57 57.45,104.57 56.39,103.51 3_7SEGMENT1:LED5.25 55.17,103.51 53.8,104.88 49.68,104.88 48.92,104.12 48.92,103.2 43.28,97.56 3_7SEGMENT1:U$1.15
3_7SEGMENT1:N$9
  Bottom 0.152: 3_7SEGMENT1:LED5.15 79.55,103.51 78.18,104.88 69.34,104.88 67.97,103.51 3_7SEGMENT1:LED5.20 67.82,103.51 66.75,102.44 60.05,102.44 58.98,103.51 3_7SEGMENT1:LED5.24 57.76,103.51 56.69,102.44 54.86,102.44 54.25,103.05 54.25,103.35 53.03,104.57 49.84,104.57 49.23,103.96 49.23,101.98 43.28,96.04 43.28,95.12 3_7SEGMENT1:U$1.14
3_7SEGMENT1:N$10
  Top 0.152: 3_7SEGMENT1:U$1.13 43.28,92.38 43.28,91.31 46.63,87.96 46.63,87.81 47.24,87.2 48.01,87.2 49.23,88.42 49.23,88.72 49.84,89.33 54.1,89.33 55.17,88.27 3_7SEGMENT1:LED5.4
  Bottom 0.152: 3_7SEGMENT1:LED5.4 56.39,88.27 57.45,89.33 64.31,89.33 65.38,88.27 3_7SEGMENT1:LED5.8 65.53,88.27 66.6,89.33 75.89,89.33 76.96,88.27 3_7SEGMENT1:LED5.13
3_7SEGMENT1:N$11
  Top 0.152: 3_7SEGMENT1:LED5.11 73,88.27 71.93,87.2 65.08,87.2 64.01,88.27 3_7SEGMENT1:LED5.7 62.79,88.27 61.72,87.2 52.43,87.2 51.36,88.27 3_7SEGMENT1:LED5.2
  Bottom 0.152: 3_7SEGMENT1:LED5.2 49.07,88.27 47.55,89.79 43.28,89.79 3_7SEGMENT1:U$1.12
3_7SEGMENT1:N$26
  Top 0.152: 3_7SEGMENT1:LED5.10 70.41,88.27 69.34,89.33 62.48,89.33 61.42,88.27 3_7SEGMENT1:LED5.6 60.2,88.27 58.83,89.64 49.68,89.64 48.31,88.27 3_7SEGMENT1:LED5.1
  Bottom 0.152: 3_7SEGMENT1:LED5.1 44.04,88.27 43.28,87.5 3_7SEGMENT1:U$1.11
3_7SEGMENT1:N$28  (via drill 0.35)
  Top 0.152: v63.4,96.5 43.13,96.5 36.58,89.94 35.66,89.94 3_7SEGMENT1:U$1.5
  Bottom 0.152: 3_7SEGMENT1:LED5.17 75.44,103.51 74.37,104.57 72.69,104.57 71.63,103.51 3_7SEGMENT1:LED5.19 70.41,103.51 v63.4,96.5
3_7SEGMENT1:N$29
  Top 0.152: 3_7SEGMENT1:LED5.27 51.36,103.51 52.43,102.44 59.13,102.44 60.2,103.51 3_7SEGMENT1:LED5.23
  Bottom 0.152: 3_7SEGMENT1:U$1.7 35.66,84.91 35.66,85.98 42.06,92.38 42.06,92.84 43.13,93.9 43.59,93.9 50.14,100.46 50.14,103.51 3_7SEGMENT1:LED5.27
3_7SEGMENT1:N$30
  Top 0.152: 3_7SEGMENT1:LED5.28 48.77,103.51 49.84,104.57 61.72,104.57 62.79,103.51 3_7SEGMENT1:LED5.22 62.94,103.51 64.01,104.57 70.87,104.57 71.93,103.51 3_7SEGMENT1:LED5.18
  Bottom 0.152: 3_7SEGMENT1:U$1.6 35.66,87.5 35.66,88.42 42.06,94.82 42.06,98.02 42.98,98.93 43.59,98.93 47.55,102.9 47.55,103.51 3_7SEGMENT1:LED5.28
4_7SEGMENT1:N$1  (via drill 0.35)
  Top 0.152: 4_7SEGMENT1:LED2.7 54.86,75.46 56.69,73.64 76.81,73.64 78.64,75.46 4_7SEGMENT1:LED3.7 78.79,75.62 79.25,75.62 90.22,86.59 v90.22,92.53
  Bottom 0.152: 91.9,94.21 92.51,94.21 101.35,85.37 101.35,84 102.56,82.78 102.56,75.62 4_7SEGMENT1:LED4.7 | 91.9,94.21 91.29,94.82 91.29,96.95 92.2,97.87 4_7SEGMENT1:U$1.15 | 4_7SEGMENT1:LED1.7 31.09,75.46 31.7,75.46 33.53,73.64 49.84,73.64 51.36,75.16 51.36,76.68 51.97,77.29 53.19,77.29 4_7SEGMENT1:LED2.7 | v90.22,92.53 91.9,94.21
4_7SEGMENT1:N$2  (via drill 0.35)
  Top 0.152: v44.5,75.46 45.41,75.46 46.94,73.94 52.58,73.94 53.49,74.85 | 53.49,74.85 53.95,75.31 53.95,76.68 54.56,77.29 55.63,77.29 57.3,75.62 4_7SEGMENT1:LED2.6 | 4_7SEGMENT1:U$1.14 92.2,95.28 91.29,94.36 91.29,92.69 90.53,91.92 90.53,86.44 81.38,77.29 81.38,75.62 4_7SEGMENT1:LED3.6 81.23,75.46 79.1,73.33 55.02,73.33 53.49,74.85
  Bottom 0.152: v44.5,75.46 33.53,75.46 4_7SEGMENT1:LED1.6 | 4_7SEGMENT1:LED4.6 105.16,83.84 93.73,95.28 92.35,95.28 4_7SEGMENT1:U$1.14
4_7SEGMENT1:N$3
  Bottom 0.152: 54.86,44.98 53.03,43.16 51.82,43.16 51.05,43.92 51.05,45.9 49.84,47.12 33.53,47.12 31.55,45.14 31.09,45.14 4_7SEGMENT1:LED1.4 | 100.58,47.12 81.23,47.12 79.25,45.14 78.79,45.14 4_7SEGMENT1:LED3.4 78.64,44.98 77.11,43.46 75.89,43.46 75.29,44.07 75.29,45.44 73.91,46.81 70.87,46.81 67.51,43.46 57.15,43.46 55.63,44.98 54.86,44.98 | 100.58,47.12 102.56,45.14 4_7SEGMENT1:LED4.4 | 4_7SEGMENT1:U$1.13 93.42,92.84 101.04,85.22 101.04,47.57 100.58,47.12 | 54.86,44.98 4_7SEGMENT1:LED2.4
4_7SEGMENT1:N$4
  Top 0.152: 71.48,46.81 73.15,45.14 73.61,45.14 4_7SEGMENT1:LED3.2 | 71.48,46.81 51.51,46.81 49.84,45.14 4_7SEGMENT1:LED2.2 | 71.48,46.81 71.48,60.68 90.83,80.04 90.83,87.81 92.2,89.18 92.2,90.25 4_7SEGMENT1:U$1.12
  Bottom 0.152: 4_7SEGMENT1:LED1.2 25.91,44.98 26.67,44.98 28.19,43.46 43.59,43.46 46.94,46.81 48.01,46.81 49.68,45.14 4_7SEGMENT1:LED2.2 | 4_7SEGMENT1:LED4.2 96.93,45.14 95.25,46.81 84.89,46.81 81.23,43.16 75.59,43.16 73.76,44.98 4_7SEGMENT1:LED3.2
4_7SEGMENT1:N$5  (via drill 0.35)
  Top 0.152: 4_7SEGMENT1:LED3.1 71.02,44.98 59.28,44.98 57.76,43.46 48.77,43.46 47.24,44.98 4_7SEGMENT1:LED2.1 | v96.93,84.76 96.93,76.99 96.01,76.07 96.01,46.05 95.1,45.14 4_7SEGMENT1:LED4.1
  Bottom 0.152: 4_7SEGMENT1:LED1.1 23.47,44.98 24.08,44.98 25.91,43.16 45.41,43.16 47.24,44.98 4_7SEGMENT1:LED2.1 | 4_7SEGMENT1:LED4.1 94.94,44.98 83.52,44.98 81.38,42.85 73.3,42.85 71.17,44.98 4_7SEGMENT1:LED3.1 | v96.93,84.76 94.03,87.66 92.35,87.66 4_7SEGMENT1:U$1.11
4_7SEGMENT1:N$6
  Top 0.152: 4_7SEGMENT1:LED1.3 28.5,45.14 28.5,75.46 4_7SEGMENT1:LED1.8 | 4_7SEGMENT1:LED3.10 71.17,75.46 71.78,75.46 73.3,73.94 76.5,73.94 77.57,75.01 77.57,83.84 83.36,89.64 83.36,91.62 84.58,92.84 4_7SEGMENT1:U$1.4
  Bottom 0.152: 72.69,73.94 73.91,73.94 74.68,74.7 74.68,76.53 76.5,78.36 80.47,78.36 83.21,75.62 94.94,75.62 4_7SEGMENT1:LED4.10 | 72.69,73.94 71.17,75.46 4_7SEGMENT1:LED3.10 | 72.69,73.94 53.95,55.19 53.95,44.83 52.58,43.46 51.97,43.46 51.36,44.07 51.36,46.05 49.99,47.42 31.24,47.42 28.96,45.14 28.5,45.14 4_7SEGMENT1:LED1.3
4_7SEGMENT1:N$7
  Bottom 0.152: 52.43,73.94 52.43,75.46 4_7SEGMENT1:LED2.8 | 52.43,73.94 52.43,45.14 4_7SEGMENT1:LED2.3 | 73.76,77.29 73.76,79.43 80.01,85.67 | 73.76,77.29 73.76,75.62 4_7SEGMENT1:LED3.9 | 80.01,85.67 84.58,90.25 4_7SEGMENT1:U$1.5 | 80.01,85.67 84.12,81.56 90.98,81.56 96.93,75.62 4_7SEGMENT1:LED4.9 | 52.43,73.94 67.51,73.94 70.87,77.29 73.76,77.29
4_7SEGMENT1:N$8  (via drill 0.35)
  Top 0.152: v78.18,77.75 78.18,84 83.67,89.48 83.67,90.86 84.58,91.77 85.19,91.77 85.8,92.38 85.8,94.21 84.73,95.28 4_7SEGMENT1:U$1.3
  Bottom 0.152: v78.18,77.75 76.35,77.75 75.29,76.68 75.29,74.85 57.45,57.02 57.45,45.14 4_7SEGMENT1:LED2.5
4_7SEGMENT1:N$9
  Top 0.152: 4_7SEGMENT1:LED4.3 100.13,45.14 100.13,75.46 4_7SEGMENT1:LED4.8
  Bottom 0.152: 4_7SEGMENT1:LED1.9 26.52,75.62 28.19,77.29 43.59,77.29 46.94,73.94 48.16,73.94 49.68,75.46 4_7SEGMENT1:LED2.9 49.84,75.62 61.11,86.89 78.18,86.89 79.7,88.42 79.7,88.72 82.45,91.47 85.04,91.47 85.8,90.7 85.8,85.22 | 85.8,85.22 90.83,85.22 91.9,84.15 97.23,84.15 97.38,84.3 97.99,84.3 99.97,82.32 99.97,75.62 4_7SEGMENT1:LED4.8 | 85.8,85.22 4_7SEGMENT1:U$1.7
4_7SEGMENT1:N$11
  Top 0.152: 76.5,77.6 76.5,75.92 4_7SEGMENT1:LED3.8 | 76.5,77.6 76.5,88.72 84.28,96.5 85.19,96.5 86.11,95.58 86.11,90.09 84.73,88.72 84.73,87.81 4_7SEGMENT1:U$1.6 | 76.5,77.6 49.84,77.6 47.85,75.62 4_7SEGMENT1:LED2.10
  Bottom 0.152: 4_7SEGMENT1:LED1.10 23.47,75.62 23.93,75.62 25.91,77.6 45.26,77.6 4_7SEGMENT1:LED2.10 | 4_7SEGMENT1:LED3.8 4_7SEGMENT1:LED3.3
GND  (via drill 0.35)
  Top 0.152: LEDS2:U$1.8 21.49,95.43 17.22,95.43 14.63,92.84 14.63,92.53 14.17,92.08 12.95,92.08 8.08,96.95 8.08,97.26 POWER1:C3.- 8.08,97.41 12.19,101.52 12.19,106.7 POWER1:U$1.2 | LEDS2:U$1.16 30.48,89.03 34.44,85.07 34.44,83.39 35.51,82.32 3_7SEGMENT1:U$1.8 | v22.4,85.07 LEDS2:A0.3 | v26.67,85.07 26.67,86.28 LEDS2:A1.3 | LEDS2:A2.3 30.63,86.28 v30.63,85.07 30.63,80.49 34.44,76.68 34.44,38.12 MAGNETOMETER1:CY1.1 | 41,33.55 41.15,33.71 MAGNETOMETER1:U$1.2 41,33.55 | 41,33.55 40.84,33.4 MAGNETOMETER1:U$1.3 | 41.76,33.71 41.6,33.55 41,33.55 | 41.76,33.71 42.06,34.01 47.4,34.01 v51.66,29.74 58.83,22.58 59.59,22.58 LEDS3:U$1.16 | 41.76,33.71 MAGNETOMETER1:U$1.12 | 40.84,20.6 40.84,19.69 47.85,12.67 60.5,12.67 60.81,12.98 60.81,13.59 LEDS3:A0.3 | 40.84,20.6 45.72,25.48 47.4,25.48 MAGNETOMETER1:CY2.1 | 40.84,20.6 35.81,25.63 32.61,25.63 PRESSURESENSOR1:U$1.2 | LEDS1:A2.3 106.68,86.28 LEDS1:U$1.8 106.68,90.25 105.92,91.01 105,91.01 104.85,90.86 104.85,89.64 103.17,87.96 103.17,86.44 LEDS1:A1.3 103.02,86.28 v103.02,85.07 | LEDS1:U$1.16 97.69,95.89 93.42,95.89 92.81,96.5 91.9,96.5 86.41,91.01 86.41,84.45 84.73,82.78 4_7SEGMENT1:U$1.8 | 99.36,85.37 LEDS1:A0.3 | v97.69,83.69 99.36,85.37 | 101.65,83.24 101.5,83.24 99.36,85.37 | 101.65,83.24 v103.02,83.24 | 68.58,15.72 68.58,15.11 69.34,14.35 69.34,13.74 LEDS3:A2.3 | 68.58,15.72 LEDS3:U$1.8 | LEDS3:A1.3 65.08,14.5 v65.53,14.96 | v68.43,15.72 68.58,15.72 | POWER1:LIPO.2 107.14,12.52 107.44,12.52 115.82,20.9 POWER1:QIRECEIVER.2 | 94.49,39.34 94.49,37.82 POWER1:U1.2 | 94.49,39.34 95.4,40.26 POWER1:R2.2 95.56,40.26 96.62,41.33 101.65,41.33
  Top 0.152: 94.49,39.34 93.57,40.26 POWER1:R3.1 92.35,40.26 87.48,35.38 POWER1:C2.- 87.33,35.23 77.57,25.48 76.96,25.48 MSP1:S1.P$1 | 101.65,41.33 106.22,41.33 106.83,40.72 106.83,39.8 101.96,34.92 100.89,34.92 POWER1:C1.- | 101.65,41.33 101.65,83.24
  Bottom 0.152: 32.77,85.07 v30.63,85.07 v26.67,85.07 v22.4,85.07 19.96,85.07 8.08,96.95 8.08,97.26 POWER1:C3.- | 32.77,85.07 35.51,82.32 3_7SEGMENT1:U$1.8 | POWER1:C4.- 50.32,111.89 36.73,95.12 36.73,94.67 35.66,93.6 35.2,93.6 32.77,91.16 32.77,85.07 | 57.45,30.05 57.45,32.18 55.93,33.71 55.93,39.34 MSP1:U$1.20 | 57.45,30.05 MSP1:R3.P$1 58.98,28.37 58.98,27 57.76,25.78 57.76,24.87 67.06,15.57 | MAGNETOMETER1:CY1.1 34.29,37.97 34.29,27.46 32.61,25.78 PRESSURESENSOR1:U$1.2 | 57.45,30.05 51.97,30.05 v51.66,29.74 47.55,25.63 MAGNETOMETER1:CY2.1 | v97.69,83.69 92.81,83.69 92.66,83.84 85.8,83.84 84.73,82.78 4_7SEGMENT1:U$1.8 | v103.02,83.24 v103.02,85.07 | v65.53,14.96 66.45,14.96 67.06,15.57 | 67.82,16.33 76.81,25.32 MSP1:S1.P$1 | 67.82,16.33 67.06,15.57 | 67.82,16.33 v68.43,15.72 | POWER1:QIRECEIVER.2 115.82,21.06 114.15,21.06 110.8,24.41 110.8,24.87 100.89,34.77 POWER1:C1.-
  pour Bottom: 0,0.64 0,127.64 127,127.64 127,0.64
LEDS1:N$1
  Top 0.152: LEDS1:U$1.3 100.43,90.09 100.43,85.52 102.11,83.84 103.33,83.84 118.72,68.45 118.72,63.73 119.48,62.97 121.46,62.97 122.53,64.03 LEDS1:D1.K
LEDS1:N$2
  Top 0.152: LEDS1:U$1.4 101.5,90.09 101.5,87.81 100.74,87.05 100.74,85.67 102.26,84.15 110.64,84.15 117.5,77.29 118.72,77.29 120.55,79.12 LEDS1:D2.K
LEDS1:N$3
  Top 0.152: LEDS1:U$1.5 102.87,90.25 104.24,91.62 111.1,91.62 112.01,90.7 113.08,90.7 114.61,92.23 114.61,93.29 LEDS1:D3.K
LEDS1:N$4
  Top 0.152: LEDS1:U$1.6 104.24,90.25 104.24,90.7 104.85,91.31 110.95,91.31 111.86,90.4 113.69,90.4 116.13,92.84 116.13,97.87 111.1,102.9 107.9,102.9 105.46,105.33 LEDS1:D4.K
LEDS1:N$5
  Top 0.152: LEDS1:U$1.11 104.24,95.89 105,96.65 105.77,96.65 106.07,96.34 106.07,95.12 106.38,94.82 106.98,94.82 107.29,95.12 107.29,96.5 92.66,111.12 91.59,111.12 90.68,112.04 90.68,112.95 92.35,114.63 93.27,114.63 LEDS1:D5.K
LEDS1:N$6
  Top 0.152: LEDS1:U$1.12 102.87,95.89 81.99,116.76 78.03,116.76 77.27,117.53 77.27,118.59 79.25,120.57 LEDS1:D6.K
LEDS1:N$7
  Top 0.152: LEDS1:U$1.13 101.5,95.89 80.92,116.46 77.72,116.46 68.43,125.76 67.36,125.76 64.16,122.56 LEDS1:D7.K
LEDS1:N$8
  Top 0.152: LEDS1:U$1.14 100.28,95.89 100.28,96.34 80.47,116.15 49.84,116.15 48.31,117.68 48.31,119.81 48.92,120.42 LEDS1:D8.K
LEDS1:N$9
  Top 0.152: LEDS1:A2.2 105.92,86.74 105.46,87.2 105.46,90.09 LEDS1:U$1.7
LEDS1:N$10
  Top 0.152: LEDS1:U$1.10 105.31,95.73 105.31,93.9 102.26,90.86 102.26,86.44 LEDS1:A1.2
LEDS1:N$11
  Top 0.152: LEDS1:U$1.9 106.68,96.19 105.92,96.95 104.09,96.95 103.48,96.34 103.48,94.67 99.67,90.86 99.67,87.96 98.6,86.89 98.6,86.44 LEDS1:A0.2
LEDS1:N$12
  Top 0.152: LEDS1:D5.A 92.2,112.65 95.86,112.65 97.54,114.33 LEDS1:R5.P$1
LEDS1:N$13
  Top 0.152: LEDS1:D6.A 78.64,118.14 80.16,118.14 83.36,121.34 LEDS1:R6.P$1
LEDS1:N$14
  Top 0.152: LEDS1:D7.A 64.16,120.12 64.16,120.73 67.82,124.38 LEDS1:R7.P$1
LEDS1:N$15
  Top 0.152: LEDS1:D8.A 49.68,118.14 49.68,119.36 52.12,121.79 52.12,123.32 LEDS1:R8.P$1
LEDS1:N$16
  Top 0.152: LEDS1:R1.P$2 120.7,64.19 120.09,64.19 LEDS1:D1.A
LEDS1:N$18
  Top 0.152: LEDS1:D2.A 118.26,78.66 118.26,80.34 121.31,83.39 LEDS1:R2.P$2
LEDS1:N$19
  Top 0.152: LEDS1:D3.A 112.62,92.08 112.62,95.73 114.45,97.56 LEDS1:R3.P$2
LEDS1:N$20
  Top 0.152: LEDS1:D4.A 103.78,103.66 103.78,109.14 104.09,109.45 LEDS1:R4.P$2
LEDS2:N$1
  Top 0.152: LEDS2:U$1.3 28.04,95.58 28.04,102.59 37.49,112.04 37.49,113.11 35.97,114.63 35.05,114.63 LEDS2:D1.K
LEDS2:N$2
  Top 0.152: LEDS2:U$1.4 26.67,103.35 24.69,105.33 22.86,105.33 LEDS2:D2.K
LEDS2:N$3
  Top 0.152: LEDS2:U$1.5 25.3,95.58 24.23,96.65 16.76,96.65 13.56,93.45 LEDS2:D3.K
LEDS2:N$4
  Top 0.152: LEDS2:U$1.6 24.08,95.58 23.32,96.34 22.4,96.34 22.25,96.19 22.25,93.75 7.77,79.27 LEDS2:D4.K
LEDS2:N$5
  Top 0.152: LEDS2:U$1.11 24.08,89.94 23.16,90.86 22.55,90.86 22.25,90.55 22.25,87.81 23.01,87.05 23.01,77.75 9.45,64.19 9.45,63.58 8.84,62.97 6.86,62.97 5.79,64.03 LEDS2:D5.K
LEDS2:N$6
  Top 0.152: LEDS2:U$1.12 25.45,89.79 25.45,88.88 27.28,87.05 27.28,78.97 24.38,76.07 24.38,62.05 10.67,48.34 8.38,48.34 7.77,48.95 LEDS2:D6.K
LEDS2:N$7
  Top 0.152: LEDS2:U$1.13 26.67,88.11 27.58,87.2 27.58,76.68 26.82,75.92 26.82,50.62 17.07,40.87 17.07,35.69 16.31,34.92 LEDS2:D7.K
LEDS2:N$8
  Top 0.152: LEDS2:U$1.14 28.04,89.79 28.04,78.05 29.41,76.68 29.41,34.62 25.91,31.12 25.91,24.11 24.69,22.89 22.86,22.89 LEDS2:D8.K
LEDS2:N$9
  Top 0.152: LEDS2:U$1.7 22.86,95.43 27.43,90.86 28.35,90.86 28.65,90.55 28.65,88.57 29.72,87.5 29.72,86.44 LEDS2:A2.2
LEDS2:N$10
  Top 0.152: LEDS2:U$1.10 22.86,89.79 25.76,86.89 25.76,86.44 LEDS2:A1.2
LEDS2:N$11
  Top 0.152: LEDS2:U$1.9 21.64,89.79 21.64,86.44 LEDS2:A0.2
LEDS2:N$12
  Top 0.152: LEDS2:D5.A 8.23,64.19 7.47,64.19 3.81,67.84 LEDS2:R5.P$1
LEDS2:N$13
  Top 0.152: LEDS2:D6.A 10.06,49.71 8.84,49.71 6.4,52.15 5.03,52.15 LEDS2:R6.P$1
LEDS2:N$14
  Top 0.152: LEDS2:D7.A 15.7,36.3 10.97,36.3 10.06,37.21 LEDS2:R7.P$1
LEDS2:N$15
  Top 0.152: LEDS2:R8.P$1 18.9,24.26 24.23,24.26 24.54,24.56 LEDS2:D8.A
LEDS2:N$16
  Top 0.152: LEDS2:D1.A 36.12,112.65 32.46,112.65 30.79,114.33 LEDS2:R1.P$2
LEDS2:N$18
  Top 0.152: LEDS2:D2.A 24.54,103.66 19.2,103.66 18.9,103.96 LEDS2:R2.P$2
LEDS2:N$19
  Top 0.152: LEDS2:R3.P$2 10.06,91.01 14.63,91.01 15.7,92.08 LEDS2:D3.A
LEDS2:N$20
  Top 0.152: LEDS2:R4.P$2 5.03,76.07 7.62,76.07 10.06,78.51 LEDS2:D4.A
LEDS3:N$1
  Top 0.152: LEDS3:U$1.3 62.18,16.79 62.18,13.59 60.96,12.37 41.45,12.37 36.73,17.09 35.66,17.09 34.9,16.33 34.9,13.59 LEDS3:D1.K
LEDS3:N$2
  Top 0.152: LEDS3:U$1.4 63.4,16.79 63.4,15.42 62.48,14.5 62.48,13.44 60.5,11.46 49.07,11.46 48.31,10.69 48.31,8.41 48.92,7.8 LEDS3:D2.K
LEDS3:N$3
  Top 0.152: LEDS3:U$1.5 64.77,16.33 62.79,14.35 62.79,7.04 64.01,5.82 LEDS3:D3.K
LEDS3:N$4
  Top 0.152: LEDS3:U$1.6 66.14,16.79 66.14,14.05 72.39,7.8 79.25,7.8 LEDS3:D4.K
LEDS3:N$5
  Top 0.152: LEDS3:U$1.11 66.14,22.58 66.9,23.34 67.82,23.34 67.97,23.19 67.97,21.82 73.91,15.88 90.37,15.88 91.59,17.09 92.51,17.09 93.42,16.18 93.42,13.59 LEDS3:D5.K
LEDS3:N$6  (via drill 0.35)
  Top 0.152: LEDS3:U$1.12 64.77,19.38 v63.55,18.16
  Bottom 0.152: v63.55,18.16 63.55,16.03 65.23,14.35 72.85,14.35 81.23,22.73 105.31,22.73 LEDS3:D6.K
LEDS3:N$7
  Top 0.152: LEDS3:U$1.13 63.55,22.58 63.55,23.04 64.47,23.95 71.32,23.95 79.1,16.18 81.23,16.18 86.11,21.06 86.11,31.27 90.83,35.99 93.88,35.99 94.79,35.08 94.79,34.47 95.71,33.55 108.05,33.55 112.01,37.52 113.08,37.52 114.61,35.99 114.61,34.92 LEDS3:D7.K
LEDS3:N$8  (via drill 0.35)
  Top 0.152: v60.81,20.75 62.18,22.12 62.18,22.43 LEDS3:U$1.14
  Bottom 0.152: v60.81,20.75 60.81,18.31 66.9,12.22 105.16,12.22 112.62,19.69 116.43,19.69 117.2,20.45 117.2,36.75 116.89,37.06 116.89,45.29 120.55,48.95 LEDS3:D8.K
LEDS3:N$9
  Top 0.152: LEDS3:A2.2 68.58,14.2 67.36,15.42 67.36,16.79 LEDS3:U$1.7
LEDS3:N$10
  Top 0.152: LEDS3:U$1.10 67.21,22.43 67.21,19.38 65.38,17.55 65.38,15.72 64.31,14.66 64.31,13.59 LEDS3:A1.2
LEDS3:N$11
  Top 0.152: LEDS3:U$1.9 68.58,23.04 67.97,23.65 64.62,23.65 64.16,23.19 64.16,20.14 61.57,17.55 61.57,15.57 60.2,14.2 60.2,13.59 LEDS3:A0.2
LEDS3:N$12
  Top 0.152: LEDS3:R5.P$1 91.14,10.08 91.14,14.81 92.05,15.72 LEDS3:D5.A
LEDS3:N$13
  Top 0.152: LEDS3:D6.A 103.78,24.56 103.78,19.23 104.09,18.92 LEDS3:R6.P$1
LEDS3:N$14
  Top 0.152: LEDS3:D7.A 112.62,36.14 112.62,32.64 114.45,30.81 LEDS3:R7.P$1
LEDS3:N$15
  Top 0.152: LEDS3:D8.A 118.26,49.55 118.26,48.03 121.31,44.98 LEDS3:R8.P$1
LEDS3:N$16
  Top 0.152: LEDS3:D1.A 36.27,15.72 36.27,11 37.19,10.08 LEDS3:R1.P$2
LEDS3:N$18
  Top 0.152: LEDS3:D2.A 49.68,10.08 49.68,8.87 52.12,6.43 52.12,4.9 LEDS3:R2.P$2
LEDS3:N$19
  Top 0.152: LEDS3:D3.A 64.16,8.26 64.16,7.49 67.82,3.83 LEDS3:R3.P$2
LEDS3:N$20
  Bottom 0.152: LEDS3:R4.P$2 83.36,6.88 81.99,6.88 78.64,10.24 LEDS3:D4.A
MAGNETOMETER1:N$3
  Top 0.152: MAGNETOMETER1:U$1.4 40.23,32.94 37.95,32.94 30.94,25.93 29.87,25.93 28.96,26.85 28.96,32.49 MAGNETOMETER1:CY1.2
MSP1:N$1
  Top 0.152: MSP1:R1.P$1 51.51,39.34 51.51,38.73 58.37,31.88 MSP1:U$1.2
  Bottom 0.152: MSP1:S1.P$2 60.35,26.7 60.35,28.83 58.52,30.66 58.52,31.73 MSP1:U$1.2
MSP1:N$2
  Bottom 0.152: MSP1:U$1.3 60.96,31.73 61.57,31.73 64.77,28.52 66.6,28.52 MSP1:R3.P$2 66.75,28.52 69.19,28.52 MSP1:R2.P$1
N$1
  Bottom 0.152: POWER1:U$1.1 10.52,108.53 23.47,108.53 23.77,108.23 42.27,108.23 47.14,113.11 54.59,113.11 55.8,111.89 POWER1:C4.+ 57.17,111.89 62.05,116.76 82.75,116.76 89,123.01 POWER1:D1.C 89.15,123.01 92.35,123.01 109.73,105.64 119.18,105.64 | 119.18,105.64 124.36,105.64 POWER1:U$2.3 | 119.18,105.64 119.18,102.13 119.63,101.68 119.63,88.11 104.24,72.72 104.24,44.83 102.87,43.46 93.88,43.46 78.94,28.52 76.96,28.52 MSP1:R2.P$2
POWER1:N$2  (via drill 0.35)
  Top 0.152: v92.51,36.91 93.27,37.67 POWER1:U1.3 | POWER1:LIPO.1 105.16,14.35 103.33,14.35 87.48,30.2 POWER1:C2.+
  Bottom 0.152: POWER1:C2.+ 87.48,30.35 92.51,35.38 v92.51,36.91 98.91,36.91 106.07,44.07 106.07,60.53 122.68,77.14 122.68,103.66 POWER1:U$2.2
POWER1:N$3
  Top 0.152: POWER1:U1.1 95.25,37.67 95.25,37.36 94.18,36.3 90.37,36.3 79.4,25.32 79.4,20.3 80.01,19.69 POWER1:LD1.CR
  Bottom 0.152: POWER1:LD1.CX 80.01,14.66 80.01,15.27 78.49,16.79 78.49,18.16 80.01,19.69 POWER1:LD1.CR
POWER1:N$4
  Top 0.152: POWER1:D1.A 104.39,123.01 120.7,106.7 120.7,102.13 POWER1:U$2.1 120.85,101.98 120.85,86.28 125.73,81.41 125.73,34.16 114.3,22.73 POWER1:QIRECEIVER.1 107.9,22.73 100.89,29.74 POWER1:C1.+ 100.74,29.9 98.91,29.9 93.73,35.08 93.42,35.08 POWER1:U1.4
  Bottom 0.152: 90.68,25.02 96.01,25.02 100.74,29.74 POWER1:C1.+ | 90.68,25.02 89,26.7 76.81,26.7 75.59,27.92 75.59,28.98 77.11,30.51 77.11,32.18 82.3,37.36 82.3,40.26 POWER1:R3.2 | 90.68,25.02 POWER1:R1.1
POWER1:N$6
  Top 0.152: POWER1:R2.1 104.39,40.26 99.36,35.23 95.4,35.23 POWER1:U1.5
POWER1:N$7
  Top 0.152: POWER1:LD1.A 80.16,17.25 80.16,17.7 81.69,19.23 81.69,23.8 80.62,24.87 POWER1:R1.2
PRESSURESENSOR1:N$1
  Top 0.152: PRESSURESENSOR1:U$1.3 34.14,23.95 29.87,23.95 28.8,25.02 PRESSURESENSOR1:R1.P$1
SCL
  Top 0.152: 38.86,34.31 41.15,34.31 41.3,34.16 MAGNETOMETER1:U$1.1 41.45,34.16 41.6,34.16 41.76,34.31 51.36,34.31 58.98,26.7 59.59,26.7 61.27,25.02 | 38.86,34.31 32,27.46 30.79,27.46 PRESSURESENSOR1:U$1.1 | LEDS3:U$1.15 60.96,24.71 61.27,25.02 | 61.27,25.02 67.67,31.42 67.67,35.99 71.02,39.34 MSP1:U$1.14 | LEDS1:U$1.15 99.06,95.89 98.15,96.8 85.8,96.8 84.73,97.87 4_7SEGMENT1:U$1.2 84.58,98.02 83.97,98.63 42.67,98.63 41.6,97.56 35.66,97.56 3_7SEGMENT1:U$1.2 35.51,97.41 29.26,91.16 29.26,89.94 LEDS2:U$1.15 29.26,89.79 31.24,87.81 31.24,85.07 38.86,77.45 38.86,34.31
SDA
  Top 0.152: 42.98,32.94 42.98,33.1 42.52,33.55 42.37,33.55 42.22,33.4 MAGNETOMETER1:U$1.11 | 42.98,32.94 41.15,31.12 37.95,31.12 PRESSURESENSOR1:U$1.7 | 59.44,18.47 44.96,32.94 42.98,32.94 | 59.44,18.47 60.96,16.94 LEDS3:U$1.2 | 71.48,41.02 70.71,41.02 69.19,39.5 68.58,39.5 MSP1:U$1.15 | 71.48,41.02 72.08,40.41 72.08,34.77 69.49,32.18 69.49,30.51 67.97,28.98 67.97,28.07 63.25,23.34 63.09,23.34 62.79,23.04 62.79,21.82 59.44,18.47 | LEDS2:U$1.2 29.26,95.58 33.68,100 35.51,100 3_7SEGMENT1:U$1.1 35.66,100.15 41.76,100.15 42.82,101.22 83.82,101.22 84.58,100.46 4_7SEGMENT1:U$1.1 84.73,100.46 85.8,99.39 96.77,99.39 99.67,96.5 99.67,95.12 99.06,94.51 LEDS1:U$1.2 99.06,90.09 97.08,88.11 97.08,85.83 75.29,64.03 75.29,44.83 71.48,41.02

### Text on the board
tPlace: Coral Sensor Rev 1.0 | Dan Sturm & Robert Barlow